# EasyEDA schematic SallenKey2Orden.json
TITLE: Sheet_1; REV: 1.0; Date: 2024-01-04; Sheet: 1/1; Drawn By: scadesd; Company: Your Company
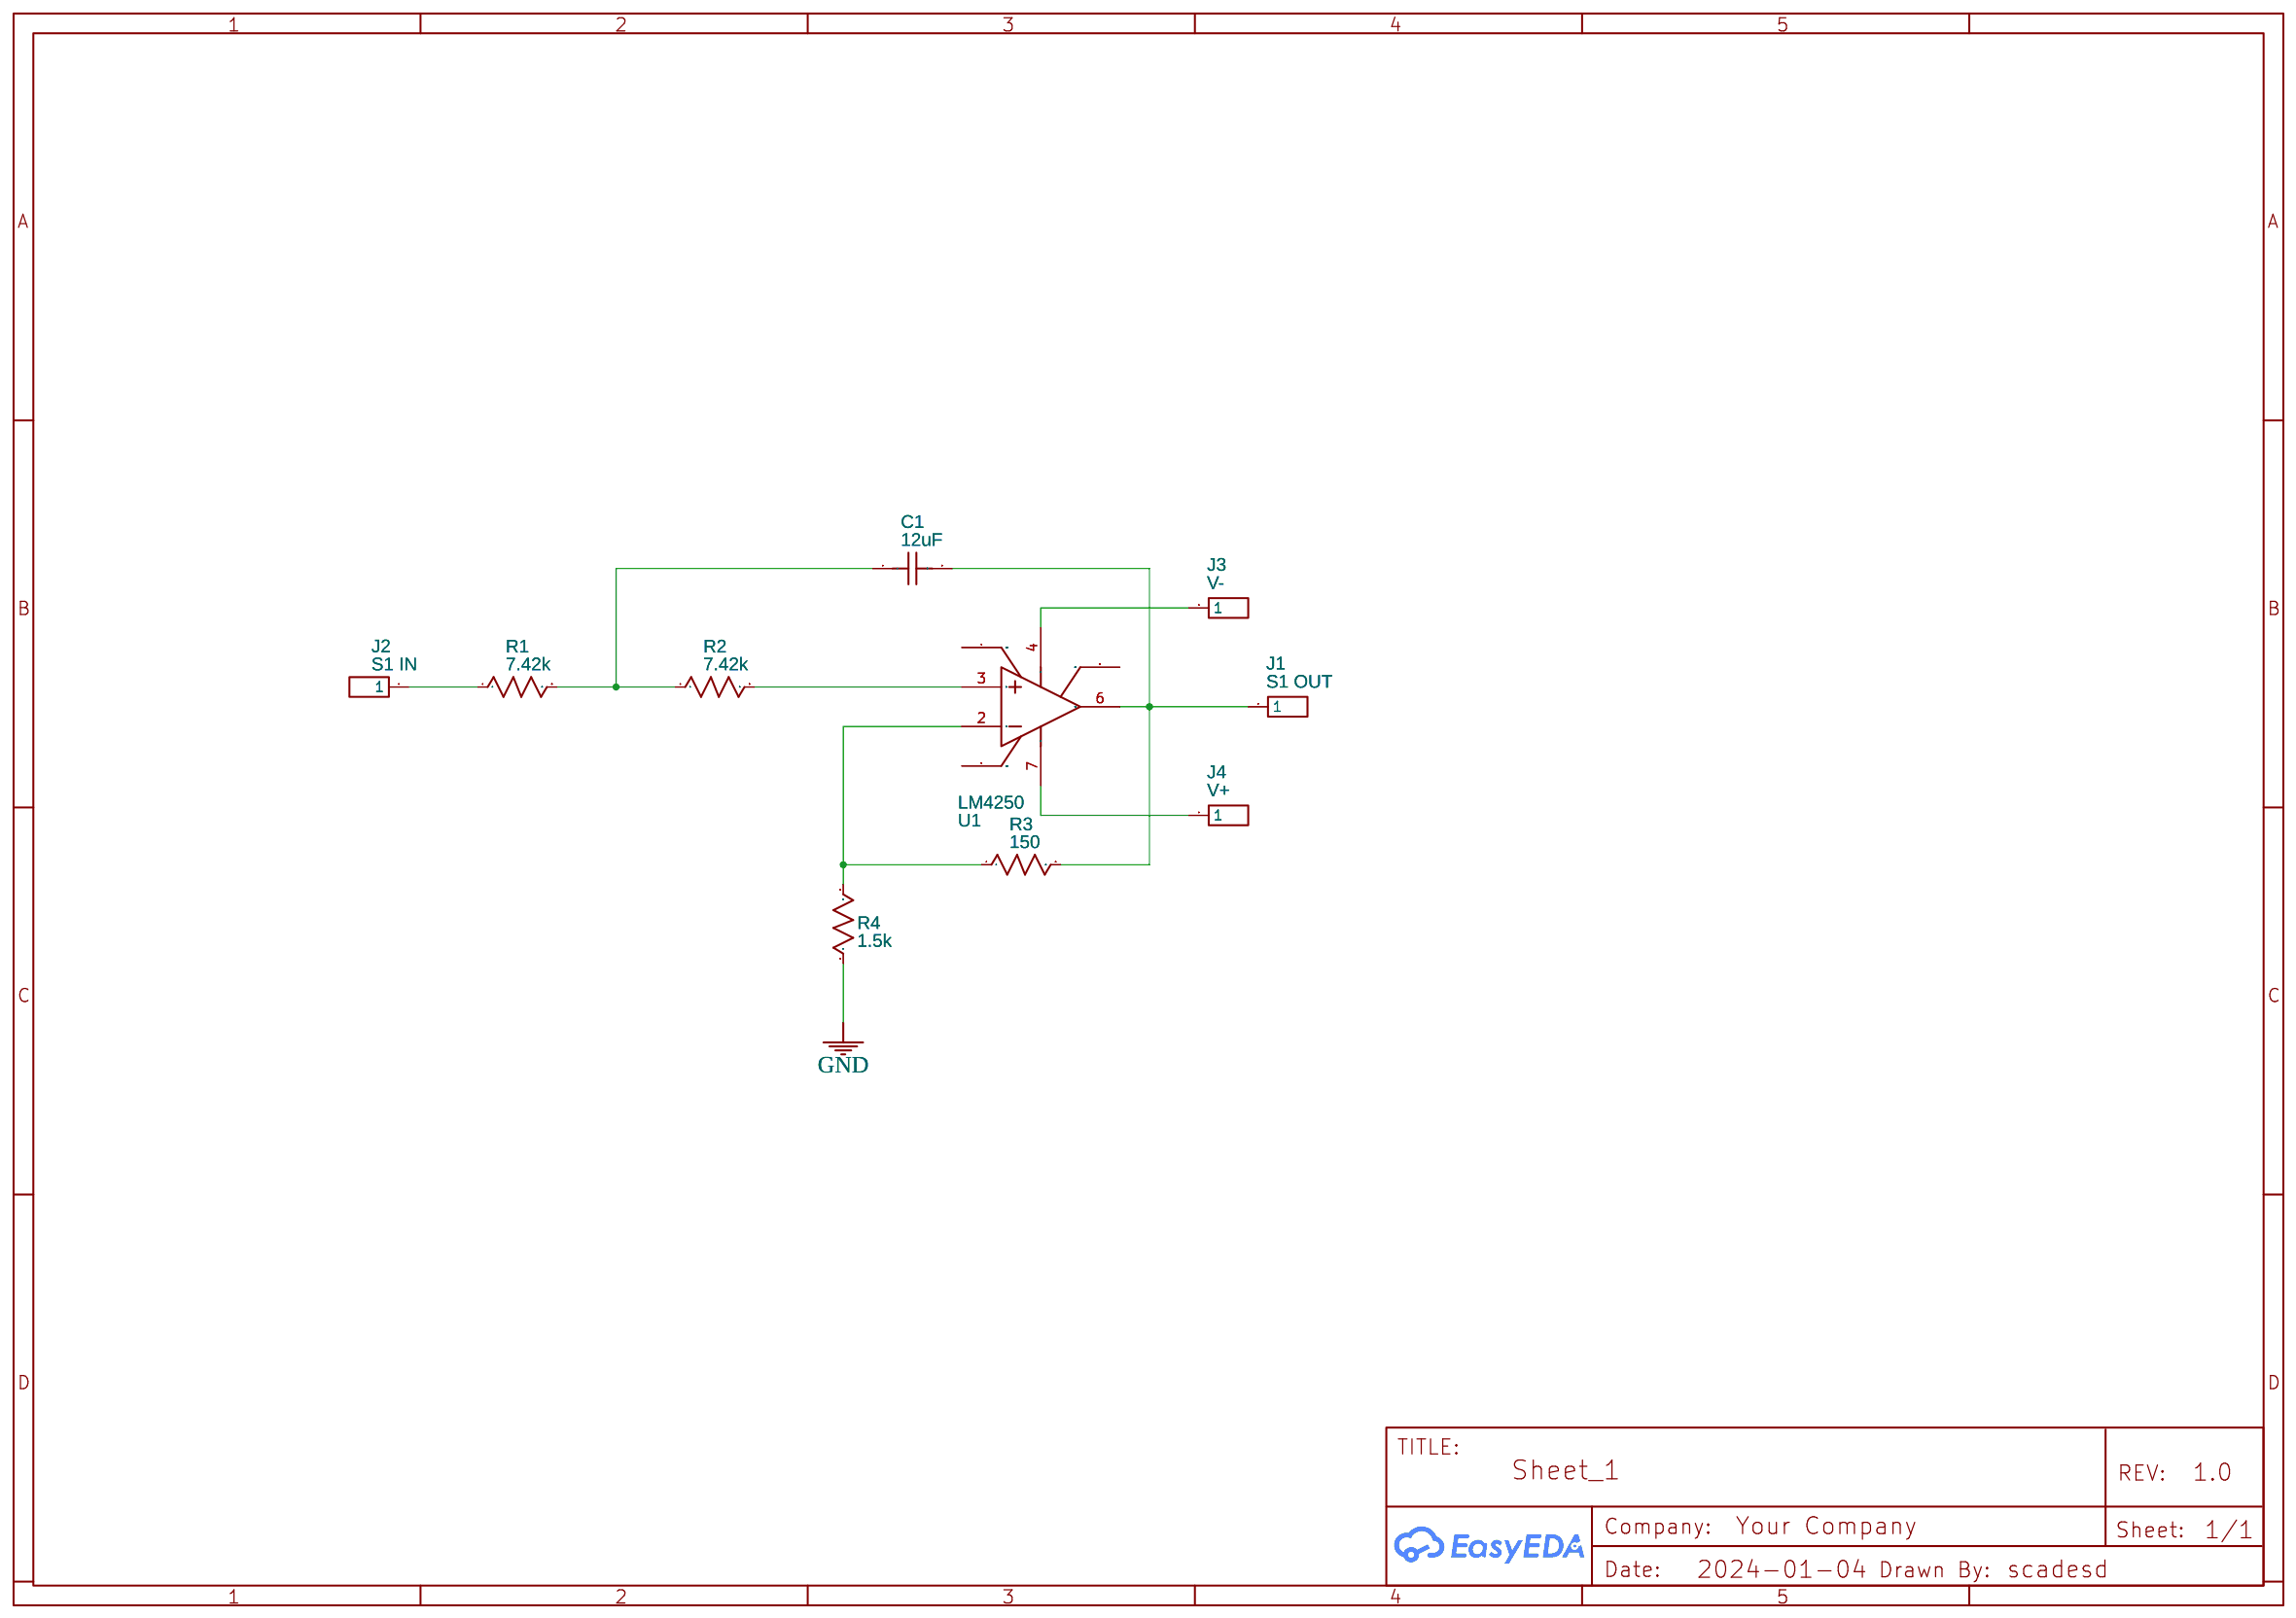
[diagram p0: schematic sheet]

## Parts
C1  12uF  [C0603]
J1  S1 OUT  [HDR-M-2.54_1X1]
J2  S1 IN  [HDR-M-2.54_1X1]
J3  V-  [HDR-M-2.54_1X1]
J4  V+  [HDR-M-2.54_1X1]
R1  7.42k  [R0603]
R2  7.42k  [R0603]
R3  150  [R0603]
R4  1.5k  [R0603]
U1  LM4250  [DIP-8_L10.1-W6.3-P2.54-LS7.6-BL]

## Library data of the parts
C1 = C_0603_US: Contributor: LCEDA_Lib
J1-J4 = HDR-M-2.54_1x1: Supplier Part: C81276; Supplier: LCSC; Contributor: LCEDA_Lib
R1-R4 = R_0603_US: Contributor: LCEDA_Lib
U1 = LM4250CN/NOPB: Contributor: LCSC; Supplier: LCSC; Supplier Part: C69233; Manufacturer: TI(德州仪器); JLCPCB Part Class: Extended Part

## Nets
GND: R4.1
Net-(C1-1): C1.1 R1.2 R2.1
Net-(C1-2): C1.2 J1.1 R3.2 U1.6(OUT)
Net-(J2-1): J2.1 R1.1
Net-(J3-1): J3.1 U1.4(V-)
Net-(J4-1): J4.1 U1.7(V+)
Net-(R2-2): R2.2 U1.3(IN+)
Net-(R3-1): R3.1 R4.2 U1.2(IN-)

Not connected (* = marked no-connect by the designer): U1 1(OFS NULL) 5(OFS NULL) 8(I SET)
